# Altium schematic sheet Display.SchDoc
size A4
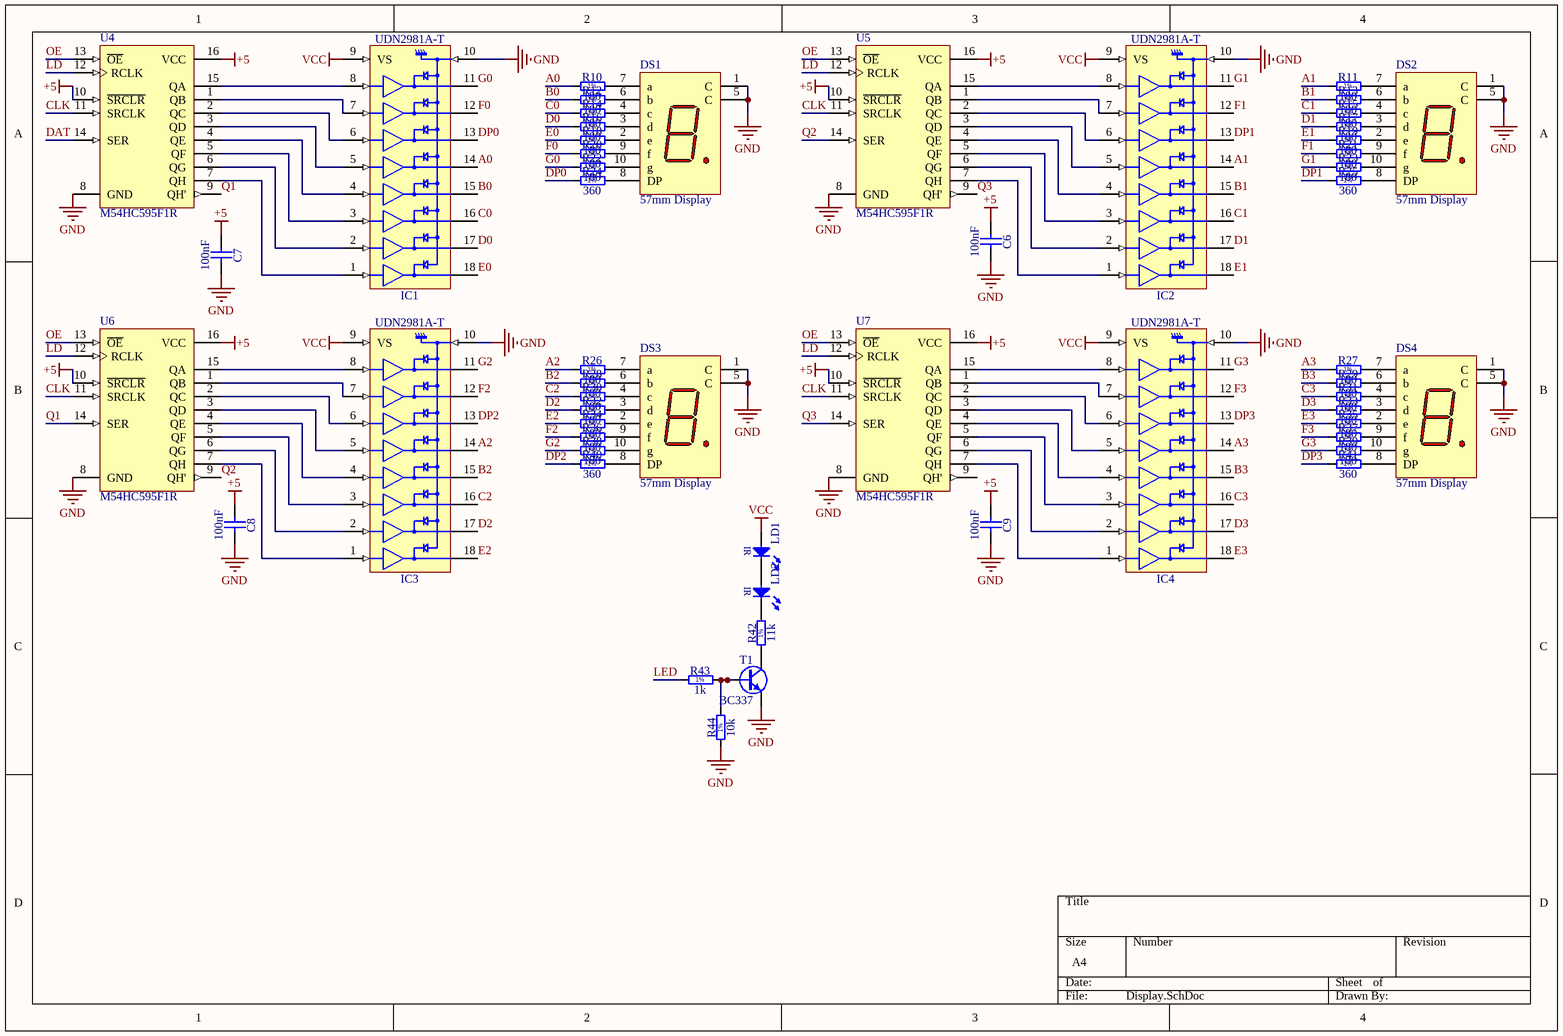
[diagram p0: Display.SchDoc]

## Parts
C6  100nF  [CAPRR508-350X500X500]
C7  100nF  [CAPRR508-350X500X500]
C8  100nF  [CAPRR508-350X500X500]
C9  100nF  [CAPRR508-350X500X500]
DS1  57mm Display  [57mm 7 Segment]
DS2  57mm Display  [57mm 7 Segment]
DS3  57mm Display  [57mm 7 Segment]
DS4  57mm Display  [57mm 7 Segment]
IC1  UDN2981A-T  [DIP18-300]
IC2  UDN2981A-T  [DIP18-300]
IC3  UDN2981A-T  [DIP18-300]
IC4  UDN2981A-T  [DIP18-300]
LD1  IR  [LED_VISHAY_TSAL6200]  (value not drawn)
LD2  IR  [LED_VISHAY_TSAL6200]  (value not drawn)
R10  180  [RES1016-630X250]
R11  180  [RES1016-630X250]
R12  180  [RES1016-630X250]
R13  180  [RES1016-630X250]
R14  180  [RES1016-630X250]
R15  180  [RES1016-630X250]
R16  180  [RES1016-630X250]
R17  180  [RES1016-630X250]
R18  180  [RES1016-630X250]
R19  180  [RES1016-630X250]
R20  180  [RES1016-630X250]
R21  180  [RES1016-630X250]
R22  180  [RES1016-630X250]
R23  180  [RES1016-630X250]
R24  360  [RES1016-630X250]
R25  360  [RES1016-630X250]
R26  180  [RES1016-630X250]
R27  180  [RES1016-630X250]
R28  180  [RES1016-630X250]
R29  180  [RES1016-630X250]
R30  180  [RES1016-630X250]
R31  180  [RES1016-630X250]
R32  180  [RES1016-630X250]
R33  180  [RES1016-630X250]
R34  180  [RES1016-630X250]
R35  180  [RES1016-630X250]
R36  180  [RES1016-630X250]
R37  180  [RES1016-630X250]
R38  180  [RES1016-630X250]
R39  180  [RES1016-630X250]
R40  360  [RES1016-630X250]
R41  360  [RES1016-630X250]
R42  11k  [RES1016-630X250]
R43  1k  [RES1016-630X250]
R44  10k  [RES1016-630X250]
T1  BC337  [TO-92AA-P254]
U4  M54HC595F1R  [DIP16]
U5  M54HC595F1R  [DIP16]
U6  M54HC595F1R  [DIP16]
U7  M54HC595F1R  [DIP16]

## Nets
+5: C6.1 C7.1 C8.1 C9.1 U4.10(~{SRCLR}) U4.16(VCC) U5.10(~{SRCLR}) U5.16(VCC) U6.10(~{SRCLR}) U6.16(VCC) U7.10(~{SRCLR}) U7.16(VCC)
GND: C6.2 C7.2 C8.2 C9.2 DS1.1(C) DS1.5(C) DS2.1(C) DS2.5(C) DS3.1(C) DS3.5(C) DS4.1(C) DS4.5(C) IC1.10(COM) IC2.10(COM) IC3.10(COM) IC4.10(COM) R44.1 T1.3(E) U4.8(GND) U5.8(GND) U6.8(GND) U7.8(GND)
VCC: IC1.9(VS) IC2.9(VS) IC3.9(VS) IC4.9(VS) LD1.2(A)
A0: IC1.14(O5) R10.1
A1: IC2.14(O5) R11.1
A2: IC3.14(O5) R26.1
A3: IC4.14(O5) R27.1
B0: IC1.15(O4) R12.1
B1: IC2.15(O4) R13.1
B2: IC3.15(O4) R28.1
B3: IC4.15(O4) R29.1
C0: IC1.16(O3) R14.1
C1: IC2.16(O3) R15.1
C2: IC3.16(O3) R30.1
C3: IC4.16(O3) R31.1
CLK: U4.11(SRCLK) U5.11(SRCLK) U6.11(SRCLK) U7.11(SRCLK)
D0: IC1.17(O2) R16.1
D1: IC2.17(O2) R17.1
D2: IC3.17(O2) R32.1
D3: IC4.17(O2) R33.1
DAT: U4.14(SER)
DP0: IC1.13(O6) R24.1
DP1: IC2.13(O6) R25.1
DP2: IC3.13(O6) R40.1
DP3: IC4.13(O6) R41.1
E0: IC1.18(O1) R18.1
E1: IC2.18(O1) R19.1
E2: IC3.18(O1) R34.1
E3: IC4.18(O1) R35.1
F0: IC1.12(O7) R20.1
F1: IC2.12(O7) R21.1
F2: IC3.12(O7) R36.1
F3: IC4.12(O7) R37.1
G0: IC1.11(O8) R22.1
G1: IC2.11(O8) R23.1
G2: IC3.11(O8) R38.1
G3: IC4.11(O8) R39.1
LD: U4.12(RCLK) U5.12(RCLK) U6.12(RCLK) U7.12(RCLK)
LED: R43.1
OE: U4.13(~{OE}) U5.13(~{OE}) U6.13(~{OE}) U7.13(~{OE})
Q1: U4.9(QH') U6.14(SER)
Q2: U5.14(SER) U6.9(QH')
Q3: U5.9(QH') U7.14(SER)
NetDS1_2: DS1.2(e) R18.2
NetDS1_3: DS1.3(d) R16.2
NetDS1_4: DS1.4(c) R14.2
NetDS1_6: DS1.6(b) R12.2
NetDS1_7: DS1.7(a) R10.2
NetDS1_8: DS1.8(DP) R24.2
NetDS1_9: DS1.9(f) R20.2
NetDS1_10: DS1.10(g) R22.2
NetDS2_2: DS2.2(e) R19.2
NetDS2_3: DS2.3(d) R17.2
NetDS2_4: DS2.4(c) R15.2
NetDS2_6: DS2.6(b) R13.2
NetDS2_7: DS2.7(a) R11.2
NetDS2_8: DS2.8(DP) R25.2
NetDS2_9: DS2.9(f) R21.2
NetDS2_10: DS2.10(g) R23.2
NetDS3_2: DS3.2(e) R34.2
NetDS3_3: DS3.3(d) R32.2
NetDS3_4: DS3.4(c) R30.2
NetDS3_6: DS3.6(b) R28.2
NetDS3_7: DS3.7(a) R26.2
NetDS3_8: DS3.8(DP) R40.2
NetDS3_9: DS3.9(f) R36.2
NetDS3_10: DS3.10(g) R38.2
NetDS4_2: DS4.2(e) R35.2
NetDS4_3: DS4.3(d) R33.2
NetDS4_4: DS4.4(c) R31.2
NetDS4_6: DS4.6(b) R29.2
NetDS4_7: DS4.7(a) R27.2
NetDS4_8: DS4.8(DP) R41.2
NetDS4_9: DS4.9(f) R37.2
NetDS4_10: DS4.10(g) R39.2
NetIC1_1: IC1.1(I1) U4.7(QH)
NetIC1_2: IC1.2(I2) U4.6(QG)
NetIC1_3: IC1.3(I3) U4.5(QF)
NetIC1_4: IC1.4(I4) U4.4(QE)
NetIC1_5: IC1.5(I5) U4.3(QD)
NetIC1_6: IC1.6(I6) U4.2(QC)
NetIC1_7: IC1.7(I7) U4.1(QB)
NetIC1_8: IC1.8(I8) U4.15(QA)
NetIC2_1: IC2.1(I1) U5.7(QH)
NetIC2_2: IC2.2(I2) U5.6(QG)
NetIC2_3: IC2.3(I3) U5.5(QF)
NetIC2_4: IC2.4(I4) U5.4(QE)
NetIC2_5: IC2.5(I5) U5.3(QD)
NetIC2_6: IC2.6(I6) U5.2(QC)
NetIC2_7: IC2.7(I7) U5.1(QB)
NetIC2_8: IC2.8(I8) U5.15(QA)
NetIC3_1: IC3.1(I1) U6.7(QH)
NetIC3_2: IC3.2(I2) U6.6(QG)
NetIC3_3: IC3.3(I3) U6.5(QF)
NetIC3_4: IC3.4(I4) U6.4(QE)
NetIC3_5: IC3.5(I5) U6.3(QD)
NetIC3_6: IC3.6(I6) U6.2(QC)
NetIC3_7: IC3.7(I7) U6.1(QB)
NetIC3_8: IC3.8(I8) U6.15(QA)
NetIC4_1: IC4.1(I1) U7.7(QH)
NetIC4_2: IC4.2(I2) U7.6(QG)
NetIC4_3: IC4.3(I3) U7.5(QF)
NetIC4_4: IC4.4(I4) U7.4(QE)
NetIC4_5: IC4.5(I5) U7.3(QD)
NetIC4_6: IC4.6(I6) U7.2(QC)
NetIC4_7: IC4.7(I7) U7.1(QB)
NetIC4_8: IC4.8(I8) U7.15(QA)
NetLD1_1: LD1.1(C) LD2.2(A)
NetLD2_1: LD2.1(C) R42.2
NetR42_1: R42.1 T1.1(C)
NetR43_2: R43.2 R44.2 T1.2(B)

Not connected (* = marked no-connect by the designer): U7 9(QH')

## Notes on the sheet
- (in symbol RMF_1K_1%_0.6W_50PPM_1016-630X250) 1%
- (in symbol RMF_10K_1%_0.6W_50PPM_1016-630X250) 1%
- (in symbol RMF_11K_1%_0.6W_50PPM_1016-630X250) 1%
- (in symbol RMF_180R_1%_0.6W_50PPM_1016-630X250) 1%
- (in symbol RMF_360R_1%_0.6W_50PPM_1016-630X250) 1%

## Library data of the parts
C6-C9 = CCR_100NF_50V_10%_X7R_508-350X500X500: Non-polarised capacitor; Part Description: Radial Lead Type Monolithic Ceramic Capacitor; Manufacturer: MURATA; Manufacturer Part Number: RPER71H104K2M1A03A; Status Comment: Can be replaced by KEMET C322C104K5R5TA; Voltage: 50VDC; TC: X7R; Tolerance: ±10%; Part Number: CCR_100NF_50V_10%_X7R_508-350X500X500; Component Kind: Standard; Component Type: Standard; Pin Count: 2; Value: 100nF; Status: Obsolete; Case: LS5.08 W3.5 x L5 x H5; Mounted: Yes; Socket: No; SMD: No; Sense: No; ComponentHeight: 5.0mm; HelpURL: \\cern.ch\dfs\Applications\Altium\Datasheets\CCR_MURATA_RPE.pdf; Author: CERN DEM JLC; CreateDate: 28.01.2008; LatestRevisionDate: 3.08.2016
DS1-DS4 = 57mm 2.3" Display
IC1-IC4 = UDN2981A-T: 8-Channel Source Drivers; Manufacturer: ALLEGRO MICROSYSTEM; PressFit: No; Bonding: No; Part Number: UDN2981A-T; Component Kind: Standard; Component Type: Standard; Device: UDN2981A-T; PackageDescription: DIP 18 Leads, Row Spacing 7.62 mm; Pitch 2.54 mm; Part Description: 8-Channel Source Drivers; Manufacturer Part Number: UDN2981A-T; Pin Count: 18; Case: DIP18-300; Mounted: Yes; Socket: Yes; SMD: No; Sense: No; ComponentHeight: 5.33mm; Author: CERN DEM JLC; HelpURL: \\cern.ch\dfs\Applications\Altium\Datasheets\UDN2981A-T.pdf; CreateDate: 7.01.2010; LatestRevisionDate: 7.01.2010
LD1 LD2 = LED_VISHAY_TSAL6200: LED Infrared Emitting Diode 1C 2A; Part Description: 5mm High Power Infrared Emitting Diode, 940 nm, GaAlAs/GaAs; Manufacturer: VISHAY SEMICONDUCTORS; PressFit: No; Bonding: No; Part Number: LED_VISHAY_TSAL6200; Component Kind: Standard; Component Type: Standard; Color: IR; PackageDescription: 5mm Infrared Emitting Diode, VISHAY TSAL; Manufacturer Part Number: TSAL6200; Pin Count: 2; Mounted: Yes; Socket: No; SMD: No; Sense: No; ComponentHeight: 13.7mm; HelpURL: \\cern.ch\dfs\Applications\Altium\Datasheets\LED_VISHAY_TSAL6200.pdf; Author: CERN DEM JMW; CreateDate: 10.01.2011; LatestRevisionDate: 10.01.2011
R10-R23 R26-R39 = RMF_180R_1%_0.6W_50PPM_1016-630X250: Resistor - 1%; Part Description: Leaded Metal Film Resistor; Manufacturer: GENERIC; Manufacturer1 Part Number: MBB02070C1800FCT00; Power: 0.6W; TC: ±50ppm/°C; PressFit: No; Part Number: RMF_180R_1%_0.6W_50PPM_1016-630X250; Component Kind: Standard; Component Type: Standard; Pin Count: 2; Value: 180; Status: Preferred; Tolerance: ±1%; Manufacturer Part Number: RMF_180R_1%_0.6W_50PPM_1016-630X250; Case: LS10.16 L6.3 x D2.5; Mounted: Yes; Sense: No; Socket: No; SMD: No; ComponentHeight: 2.5mm; Manufacturer1 Example: VISHAY BEYSCHLAG; Manufacturer1 ComponentHeight: 2.5mm; HelpURL: \\cern.ch\dfs\Applications\Altium\Datasheets\RMF_VISHAY_MBB0207.pdf; Author: CERN DEM JLC; CreateDate: 4.12.2007; LatestRevisionDate: 7.04.2008
R24 R25 R40 R41 = RMF_360R_1%_0.6W_50PPM_1016-630X250: Resistor - 1%; Part Description: Leaded Metal Film Resistor; Manufacturer: GENERIC; Manufacturer1 Part Number: MBB02070C3600FCT00; Power: 0.6W; TC: ±50ppm/°C; PressFit: No; Part Number: RMF_360R_1%_0.6W_50PPM_1016-630X250; Component Kind: Standard; Component Type: Standard; Pin Count: 2; Value: 360; Status: Preferred; Tolerance: ±1%; Manufacturer Part Number: RMF_360R_1%_0.6W_50PPM_1016-630X250; Case: LS10.16 L6.3 x D2.5; Mounted: Yes; Sense: No; Socket: No; SMD: No; ComponentHeight: 2.5mm; Manufacturer1 Example: VISHAY BEYSCHLAG; Manufacturer1 ComponentHeight: 2.5mm; HelpURL: \\cern.ch\dfs\Applications\Altium\Datasheets\RMF_VISHAY_MBB0207.pdf; Author: CERN DEM JLC; CreateDate: 4.12.2007; LatestRevisionDate: 7.04.2008
R42 = RMF_11K_1%_0.6W_50PPM_1016-630X250: Resistor - 1%; Part Description: Leaded Metal Film Resistor; Manufacturer: GENERIC; Manufacturer1 Part Number: MBB02070C1102FCT00; Power: 0.6W; TC: ±50ppm/°C; PressFit: No; Part Number: RMF_11K_1%_0.6W_50PPM_1016-630X250; Component Kind: Standard; Component Type: Standard; Pin Count: 2; Value: 11k; Status: Preferred; Tolerance: ±1%; Manufacturer Part Number: RMF_11K_1%_0.6W_50PPM_1016-630X250; Case: LS10.16 L6.3 x D2.5; Mounted: Yes; Sense: No; Socket: No; SMD: No; ComponentHeight: 2.5mm; Manufacturer1 Example: VISHAY BEYSCHLAG; Manufacturer1 ComponentHeight: 2.5mm; HelpURL: \\cern.ch\dfs\Applications\Altium\Datasheets\RMF_VISHAY_MBB0207.pdf; Author: CERN DEM JLC; CreateDate: 4.12.2007; LatestRevisionDate: 7.04.2008
R43 = RMF_1K_1%_0.6W_50PPM_1016-630X250: Resistor - 1%; Part Description: Leaded Metal Film Resistor; Manufacturer: GENERIC; Manufacturer1 Part Number: MBB02070C1001FCT00; Power: 0.6W; TC: ±50ppm/°C; PressFit: No; Part Number: RMF_1K_1%_0.6W_50PPM_1016-630X250; Component Kind: Standard; Component Type: Standard; Pin Count: 2; Value: 1k; Status: Preferred; Tolerance: ±1%; Manufacturer Part Number: RMF_1K_1%_0.6W_50PPM_1016-630X250; Case: LS10.16 L6.3 x D2.5; Mounted: Yes; Sense: No; Socket: No; SMD: No; ComponentHeight: 2.5mm; Manufacturer1 Example: VISHAY BEYSCHLAG; Manufacturer1 ComponentHeight: 2.5mm; HelpURL: \\cern.ch\dfs\Applications\Altium\Datasheets\RMF_VISHAY_MBB0207.pdf; Author: CERN DEM JLC; CreateDate: 4.12.2007; LatestRevisionDate: 7.04.2008
R44 = RMF_10K_1%_0.6W_50PPM_1016-630X250: Resistor - 1%; Part Description: Leaded Metal Film Resistor; Manufacturer: GENERIC; Manufacturer1 Part Number: MBB02070C1002FCT00; Power: 0.6W; TC: ±50ppm/°C; PressFit: No; Part Number: RMF_10K_1%_0.6W_50PPM_1016-630X250; Component Kind: Standard; Component Type: Standard; Pin Count: 2; Value: 10k; Status: Preferred; Tolerance: ±1%; Manufacturer Part Number: RMF_10K_1%_0.6W_50PPM_1016-630X250; Case: LS10.16 L6.3 x D2.5; Mounted: Yes; Sense: No; Socket: No; SMD: No; ComponentHeight: 2.5mm; Manufacturer1 Example: VISHAY BEYSCHLAG; Manufacturer1 ComponentHeight: 2.5mm; HelpURL: \\cern.ch\dfs\Applications\Altium\Datasheets\RMF_VISHAY_MBB0207.pdf; Author: CERN DEM JLC; CreateDate: 4.12.2007; LatestRevisionDate: 7.04.2008
T1 = BC337: NPN Transistor; Part Description: 45V 800mA NPN Small Signal Transistor; Manufacturer: FAIRCHILD SEMICONDUCTOR; PressFit: No; Bonding: No; Part Number: BC337; Component Kind: Standard; Component Type: Standard; Device: BC337; PackageDescription: TO-92 (TO226), Pitch 2.54mm, Flat Index, 3 In-Line, Bent Leads, Body Dia. 5.3mm; Status: Obsolete; Manufacturer Part Number: BC337; Pin Count: 3; Case: TO-92; Mounted: Yes; Socket: No; SMD: No; Sense: No; ComponentHeight: 7.7mm; HelpURL: \\cern.ch\dfs\Applications\Altium\Datasheets\BC337.pdf; Author: CERN DEM JLC; CreateDate: 18.11.2008; LatestRevisionDate: 27.08.2014
U4-U7 = M54HC595F1R: 8 Bit Shift Register with Output Latches (3 STATE); Published: 8-Jun-2000; LatestRevisionDate: 06-Jun-2005; LatestRevisionNote: Stylized 3D Model Added.; DatasheetVersion: Apr-1993; PackageVersion: Apr-1996; PackageReference: DIP16; Publisher: Altium Limited; PackageDescription: DIP; 16 Leads; Row Spacing 7.62 mm; Pitch 2.54 mm; ComponentLink1Description: Manufacturer Link; ComponentLink1URL: http://www.st.com/